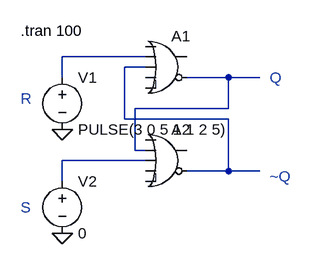
[diagram p0: schematic Actividad_5.asc]
Actividad_5.asc, the LTspice schematic file:
Version 4
SHEET 1 880 680
WIRE 176 80 48 80
WIRE 176 96 144 96
WIRE 48 112 48 80
WIRE 304 112 240 112
WIRE 352 112 304 112
WIRE 304 160 304 112
WIRE 304 160 160 160
WIRE 144 176 144 96
WIRE 304 176 144 176
WIRE 160 224 160 160
WIRE 176 224 160 224
WIRE 176 240 48 240
WIRE 304 256 304 176
WIRE 304 256 240 256
WIRE 352 256 304 256
WIRE 48 272 48 240
FLAG 48 192 0
FLAG 48 352 0
SYMBOL Digital\\or 208 32 R0
SYMATTR InstName A1
SYMBOL Digital\\or 208 176 R0
SYMATTR InstName A2
SYMBOL voltage 48 96 R0
WINDOW 123 0 0 Left 2
WINDOW 39 0 0 Left 2
SYMATTR InstName V1
SYMATTR Value PULSE(3 0 5 1 1 2 5)
SYMBOL voltage 48 256 R0
WINDOW 123 0 0 Left 2
WINDOW 39 0 0 Left 2
SYMATTR InstName V2
SYMATTR Value 0
TEXT -16 144 Left 2 ;R
TEXT -16 312 Left 2 ;S
TEXT 368 112 Left 2 ;Q
TEXT 368 264 Left 2 ;~Q
TEXT -16 40 Left 2 !.tran 100

The netlist it stands for:
* Actividad_5.asc
A1 0 N001 N002 0 0 N003 0 0 OR
A2 0 N003 N004 0 0 N002 0 0 OR
V1 N001 0 PULSE(3 0 5 1 1 2 5)
V2 N004 0 0
* R
* S
* Q
* ~Q
.tran 100
.backanno
.end